# Altium schematic sheet QCopterMV_USB_Sch.SchDoc: QCopterMV-USB
size 127 x 101 mm; Author: Hom; CompanyName: KitSprout; DrawnBy: Hom; Engineer: Hom; Organization: KitSprout; Revision: A; SheetNumber: 1; SheetTotal: 1; License: CC BY-SA 4.0; Version: 2.0; LibVersion: 2.7; PageSetup: Record=PageOptions|CenterHorizontal=True|CenterVertical=True|PrintScale=1.00|XCorrection=1.00|YCorrection=1.00|PrintKind=0|BorderSize=5000000|LeftOffset=0|BottomOffset=0|Orientation=2|PaperLength=1000|PaperWidth=1000|Scale=100|PaperSource=7|PrintQuality=-4|MediaType=1|DitherType=10|PaperKind=A4|PrintScaleMode=0
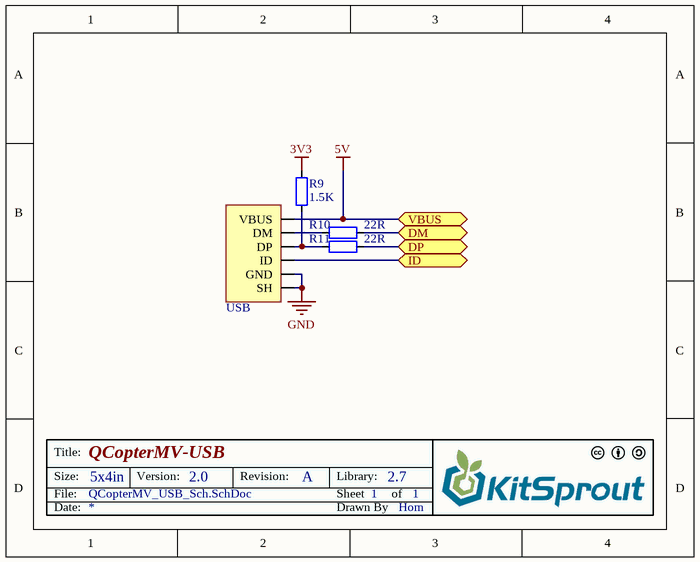
[diagram p0: QCopterMV_USB_Sch.SchDoc]

## Parts
R9  value 1.5K  [RES_0402]  (hidden comment: Res_0402)
R10  value 22R  [RES_0402]  (hidden comment: Res_0402)
R11  value 22R  [RES_0402]  (hidden comment: Res_0402)
USB  USB_Micro  [USB_Micro-AB]  (value not drawn)

## Ports
DM, DP, ID, VBUS

## Nets
3V3: R9.2
5V: USB.1(VBUS) ; port VBUS
GND: USB.0(SH) USB.5(GND)
DM: R10.1 ; port DM
DP: R11.1 ; port DP
ID: USB.4(ID) ; port ID
NetR9_1: R9.1 R11.2 USB.3(DP)
NetR10_2: R10.2 USB.2(DM)

## Notes on the sheet
- Title:
- Size:
- Date:
- File:
- 5x4in
- Version:
- Revision:
- Sheet
- Drawn By
- Library:
- of

## Library data of the parts
R9-R11 = Res_0402: Resistor
USB = USB_Micro: USB